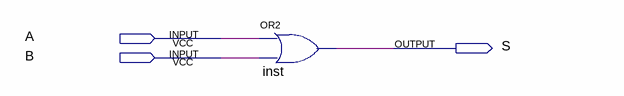
[diagram p0: schematic sheet]
// Quartus schematic or_port.bdf as structural Verilog: 1 symbols, 3 pins
module or_port (
  input  A,
  input  B,
  output S
);

  or inst (S, A, B);
endmodule
